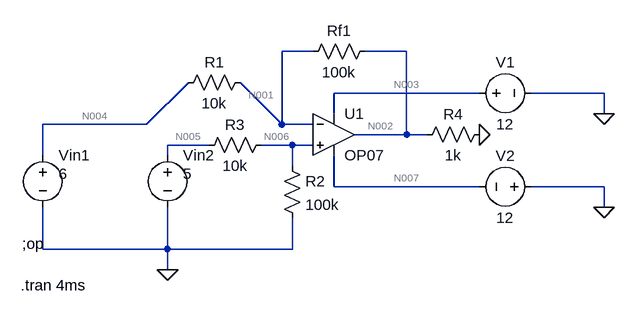
[diagram p0: schematic Differentiator.asc]
Differentiator.asc, the LTspice schematic file:
Version 4
SHEET 1 880 680
WIRE 144 16 96 16
WIRE 288 16 224 16
WIRE 400 80 176 80
WIRE 592 80 480 80
WIRE 176 112 176 80
WIRE 592 112 592 80
WIRE -112 128 -48 64
WIRE -112 128 -272 128
WIRE 96 128 96 16
WIRE 96 128 32 64
WIRE 144 128 96 128
WIRE 288 144 288 16
WIRE 288 144 208 144
WIRE 320 144 288 144
WIRE -16 160 -80 160
WIRE 112 160 64 160
WIRE 144 160 112 160
WIRE -272 176 -272 128
WIRE -80 176 -80 160
WIRE 112 192 112 160
WIRE 176 224 176 176
WIRE 400 224 176 224
WIRE 592 224 480 224
WIRE 592 256 592 224
WIRE -272 320 -272 256
WIRE -80 320 -80 256
WIRE -80 320 -272 320
WIRE 112 320 112 272
WIRE 112 320 -80 320
WIRE -80 352 -80 320
FLAG 592 112 0
FLAG 592 256 0
FLAG -80 352 0
FLAG 400 144 0
SYMBOL res 240 0 R90
WINDOW 0 0 56 VBottom 2
WINDOW 3 32 56 VTop 2
SYMATTR InstName Rf1
SYMATTR Value 100k
SYMBOL voltage -272 160 R0
WINDOW 123 0 0 Left 0
WINDOW 39 0 0 Left 0
WINDOW 3 24 44 Left 2
SYMATTR InstName Vin1
SYMATTR Value 6
SYMBOL voltage 384 80 R270
WINDOW 0 32 56 VTop 2
WINDOW 3 -32 56 VBottom 2
WINDOW 123 0 0 Left 0
WINDOW 39 0 0 Left 0
SYMATTR InstName V1
SYMATTR Value 12
SYMBOL voltage 496 224 R90
WINDOW 0 -32 56 VBottom 2
WINDOW 3 32 56 VTop 2
WINDOW 123 0 0 Left 0
WINDOW 39 0 0 Left 0
SYMATTR InstName V2
SYMATTR Value 12
SYMBOL OpAmps\\OP07 176 80 R0
SYMATTR InstName U1
SYMBOL res 48 48 R90
WINDOW 0 0 56 VBottom 2
WINDOW 3 32 56 VTop 2
SYMATTR InstName R1
SYMATTR Value 10k
SYMBOL res 96 176 R0
SYMATTR InstName R2
SYMATTR Value 100k
SYMBOL res 80 144 R90
WINDOW 0 0 56 VBottom 2
WINDOW 3 32 56 VTop 2
SYMATTR InstName R3
SYMATTR Value 10k
SYMBOL voltage -80 160 R0
WINDOW 123 0 0 Left 0
WINDOW 39 0 0 Left 0
WINDOW 3 24 44 Left 2
SYMATTR InstName Vin2
SYMATTR Value 5
SYMBOL res 416 128 R90
WINDOW 0 0 56 VBottom 2
WINDOW 3 32 56 VTop 2
SYMATTR InstName R4
SYMATTR Value 1k
TEXT -304 312 Left 2 !;op
TEXT -306 376 Left 2 !.tran 4ms

The netlist it stands for:
* Differentiator.asc
Rf1 N002 N001 100k
Vin1 N004 0 6
V1 N003 0 12
V2 0 N007 12
XU1 N006 N001 N003 N007 N002 LT1001  ; OP07, pins In+ In- V+ V- OUT
R1 N001 N004 10k
R2 N006 0 100k
R3 N006 N005 10k
Vin2 N005 0 5
R4 0 N002 1k
;op
.tran 4ms
.lib LTC.lib
.backanno
.end

* Results of the author's LTspice run, read from the files saved beside the schematic
* Operating Point, zero values left out:
*   V(n002) = -10 V
*   V(n001) = 4.545 V
*   V(n004) = 6 V
*   V(n003) = 12 V
*   V(n007) = -12 V
*   V(n006) = 4.545 V
*   V(n005) = 5 V
*   I(Rf1) = -145.5 µA
*   I(R1) = -145.5 µA
*   I(R2) = 45.45 µA
*   I(R3) = -45.45 µA
*   I(R4) = 10 mA
*   I(Vin1) = -145.5 µA
*   I(V1) = -2.291 nA
*   I(V2) = -10.15 mA
*   I(Vin2) = -45.45 µA
*   Ix(u1:1) = 7.931 pA
*   Ix(u1:2) = 8.303 pA
*   Ix(u1:3) = 2.269 nA
*   Ix(u1:4) = -10.15 mA
*   Ix(u1:5) = 10.15 mA